# EAGLE schematic Remade (EAGLE 9.1.2)
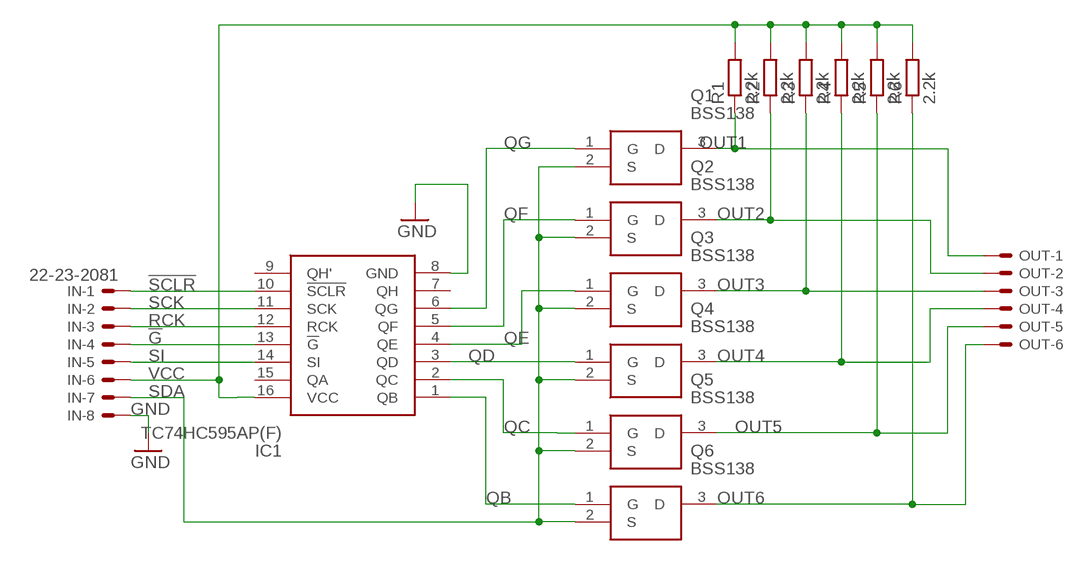
[diagram p0: schematic, sheet 1]

## Parts
IC1  TC74HC595AP(F)  [DIP762W60P254L1925H445Q16N]
IN  22-23-2081  [22-23-2081]
OUT  22-23-2061  [22-23-2061]
Q1  BSS138  [SOT95P240X120-3N]
Q2  BSS138  [SOT95P240X120-3N]
Q3  BSS138  [SOT95P240X120-3N]
Q4  BSS138  [SOT95P240X120-3N]
Q5  BSS138  [SOT95P240X120-3N]
Q6  BSS138  [SOT95P240X120-3N]
R1  2.2k  R-EU_0207/15  [0207/15]
R2  2.2k  R-EU_0207/15  [0207/15]
R3  2.2k  R-EU_0207/15  [0207/15]
R4  2.2k  R-EU_0207/15  [0207/15]
R5  2.2k  R-EU_0207/15  [0207/15]
R6  2.2k  R-EU_0207/15  [0207/15]

## Nets
!G: IC1.13(!G) IN.4
!SCLR: IC1.10(!SCLR) IN.1
GND: IC1.8(GND) IN.8
OUT1: OUT.1 Q1.3(D) R1.1
OUT2: OUT.2 Q2.3(D) R2.1
OUT3: OUT.3 Q3.3(D) R3.1
OUT4: OUT.4 Q4.3(D) R4.1
OUT5: OUT.5 Q5.3(D) R5.1
OUT6: OUT.6 Q6.3(D) R6.1
QB: IC1.1(QB) Q6.1(G)
QC: IC1.2(QC) Q5.1(G)
QD: IC1.3(QD) Q4.1(G)
QE: IC1.4(QE) Q3.1(G)
QF: IC1.5(QF) Q2.1(G)
QG: IC1.6(QG) Q1.1(G)
RCK: IC1.12(RCK) IN.3
SCK: IC1.11(SCK) IN.2
SDA: IN.7 Q1.2(S) Q2.2(S) Q3.2(S) Q4.2(S) Q5.2(S) Q6.2(S)
SI: IC1.14(SI) IN.5
VCC: IC1.16(VCC) IN.6 R1.2 R2.2 R3.2 R4.2 R5.2 R6.2
Unconnected: IC1.7(QH) IC1.9(QH') IC1.15(QA)

## Library data of the parts
IC1 = TC74HC595AP(F):TC74HC595AP(F): IC,CMOS logic,DIP16,SHIFT REGISTERS Source: Datasheet <http://toshiba.semicon-storage.com/info/docget.jsp?did=16512&prodName=TC74HC595AP>; DESCRIPTION: IC,CMOS logic,DIP16,SHIFT REGISTERS; HEIGHT: 4.45mm; MANUFACTURER_NAME: Toshiba; MANUFACTURER_PART_NUMBER: TC74HC595AP(F); MOUSER_PART_NUMBER: N/A; MOUSER_PRICE-STOCK: https://www.mouser.com/Search/Refine.aspx?Keyword=N%2FA; RS_PART_NUMBER: 5400095P; RS_PRICE-STOCK: http://au.rs-online.com/web/p/products/5400095P
IN = con-molex:22-23-2081: .100" (2.54mm) Center Header - 8 Pin; MF: MOLEX; MPN: 22-23-2081; OC_FARNELL: 1756826; OC_NEWARK: 01C7592
OUT = con-molex:22-23-2061: .100" (2.54mm) Center Header - 6 Pin; MF: MOLEX; MPN: 22-23-2061; OC_FARNELL: 1462922; OC_NEWARK: 27C1933
Q1-Q6 = BSS138:BSS138: N-channel MOSFET,BSS138 0.2A 50V Source: Datasheet <https://www.onsemi.com/pub/Collateral/BSS138-D.PDF>; DESCRIPTION: N-channel MOSFET,BSS138 0.2A 50V; HEIGHT: 1.2mm; MANUFACTURER_NAME: ON Semiconductor; MANUFACTURER_PART_NUMBER: BSS138; MOUSER_PART_NUMBER: 512-BSS138; RS_PART_NUMBER: 1241694; RS_PRICE-STOCK: http://uk.rs-online.com/web/p/products/1241694
R1-R6 = rcl:R-EU_: RESISTOR, European symbol; SPICEPREFIX: R

## Net classes
0 default: clearance 0.25 mm